# Altium schematic sheet Integrator.SchDoc
size 594 x 420 mm; Address1: Address1; Address2: Address2; Address3: Address3; Address4: Address4; SheetNumber: 1; Scale: 1:1; Разраб.: Иванов; Обозначение документа: АБВГ.123456.001 Э3; Пров.: Петров; Утв.: Сидоров; Наименование организации: ОАО "Концерн "МПО-Гидроприбор"; Перв. применение: АБВГ.123456.000; Наименование изделия 1: Плата; Наименование изделия 2: Схема электрическая; Наименование изделия 3: принципиальная; Нач. отд.: Нач. отд.; Фамилия нач. отд.: Сидоров
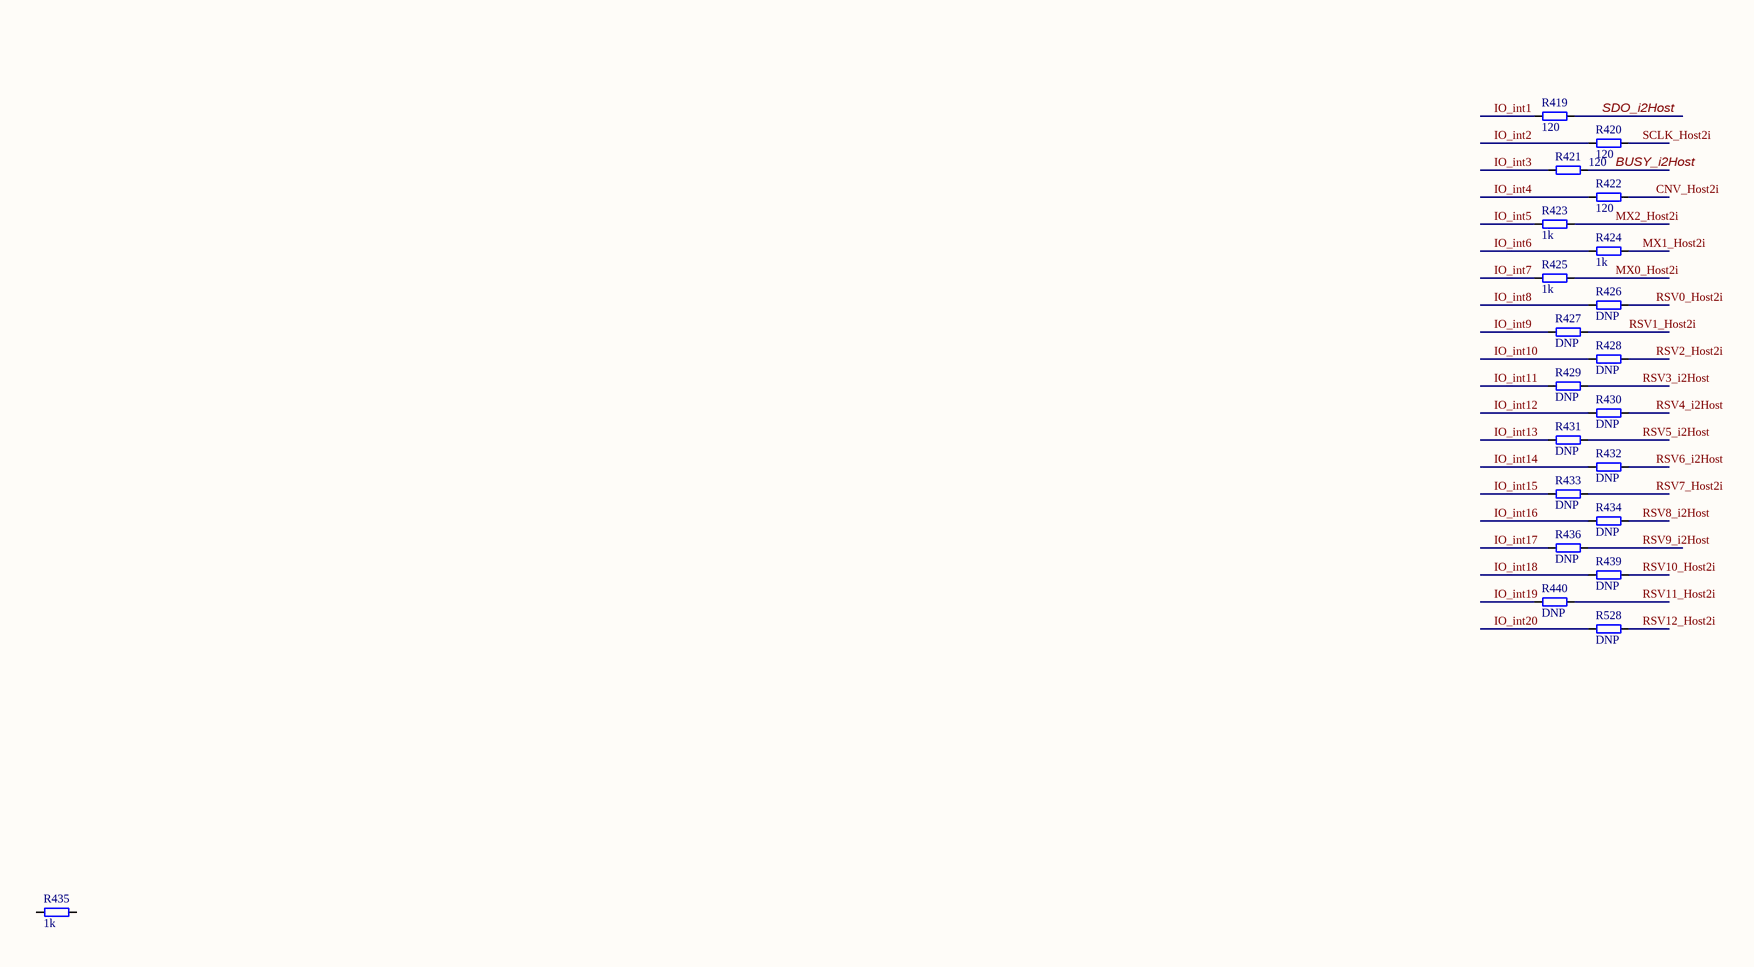
[diagram p0: Integrator.SchDoc, left]
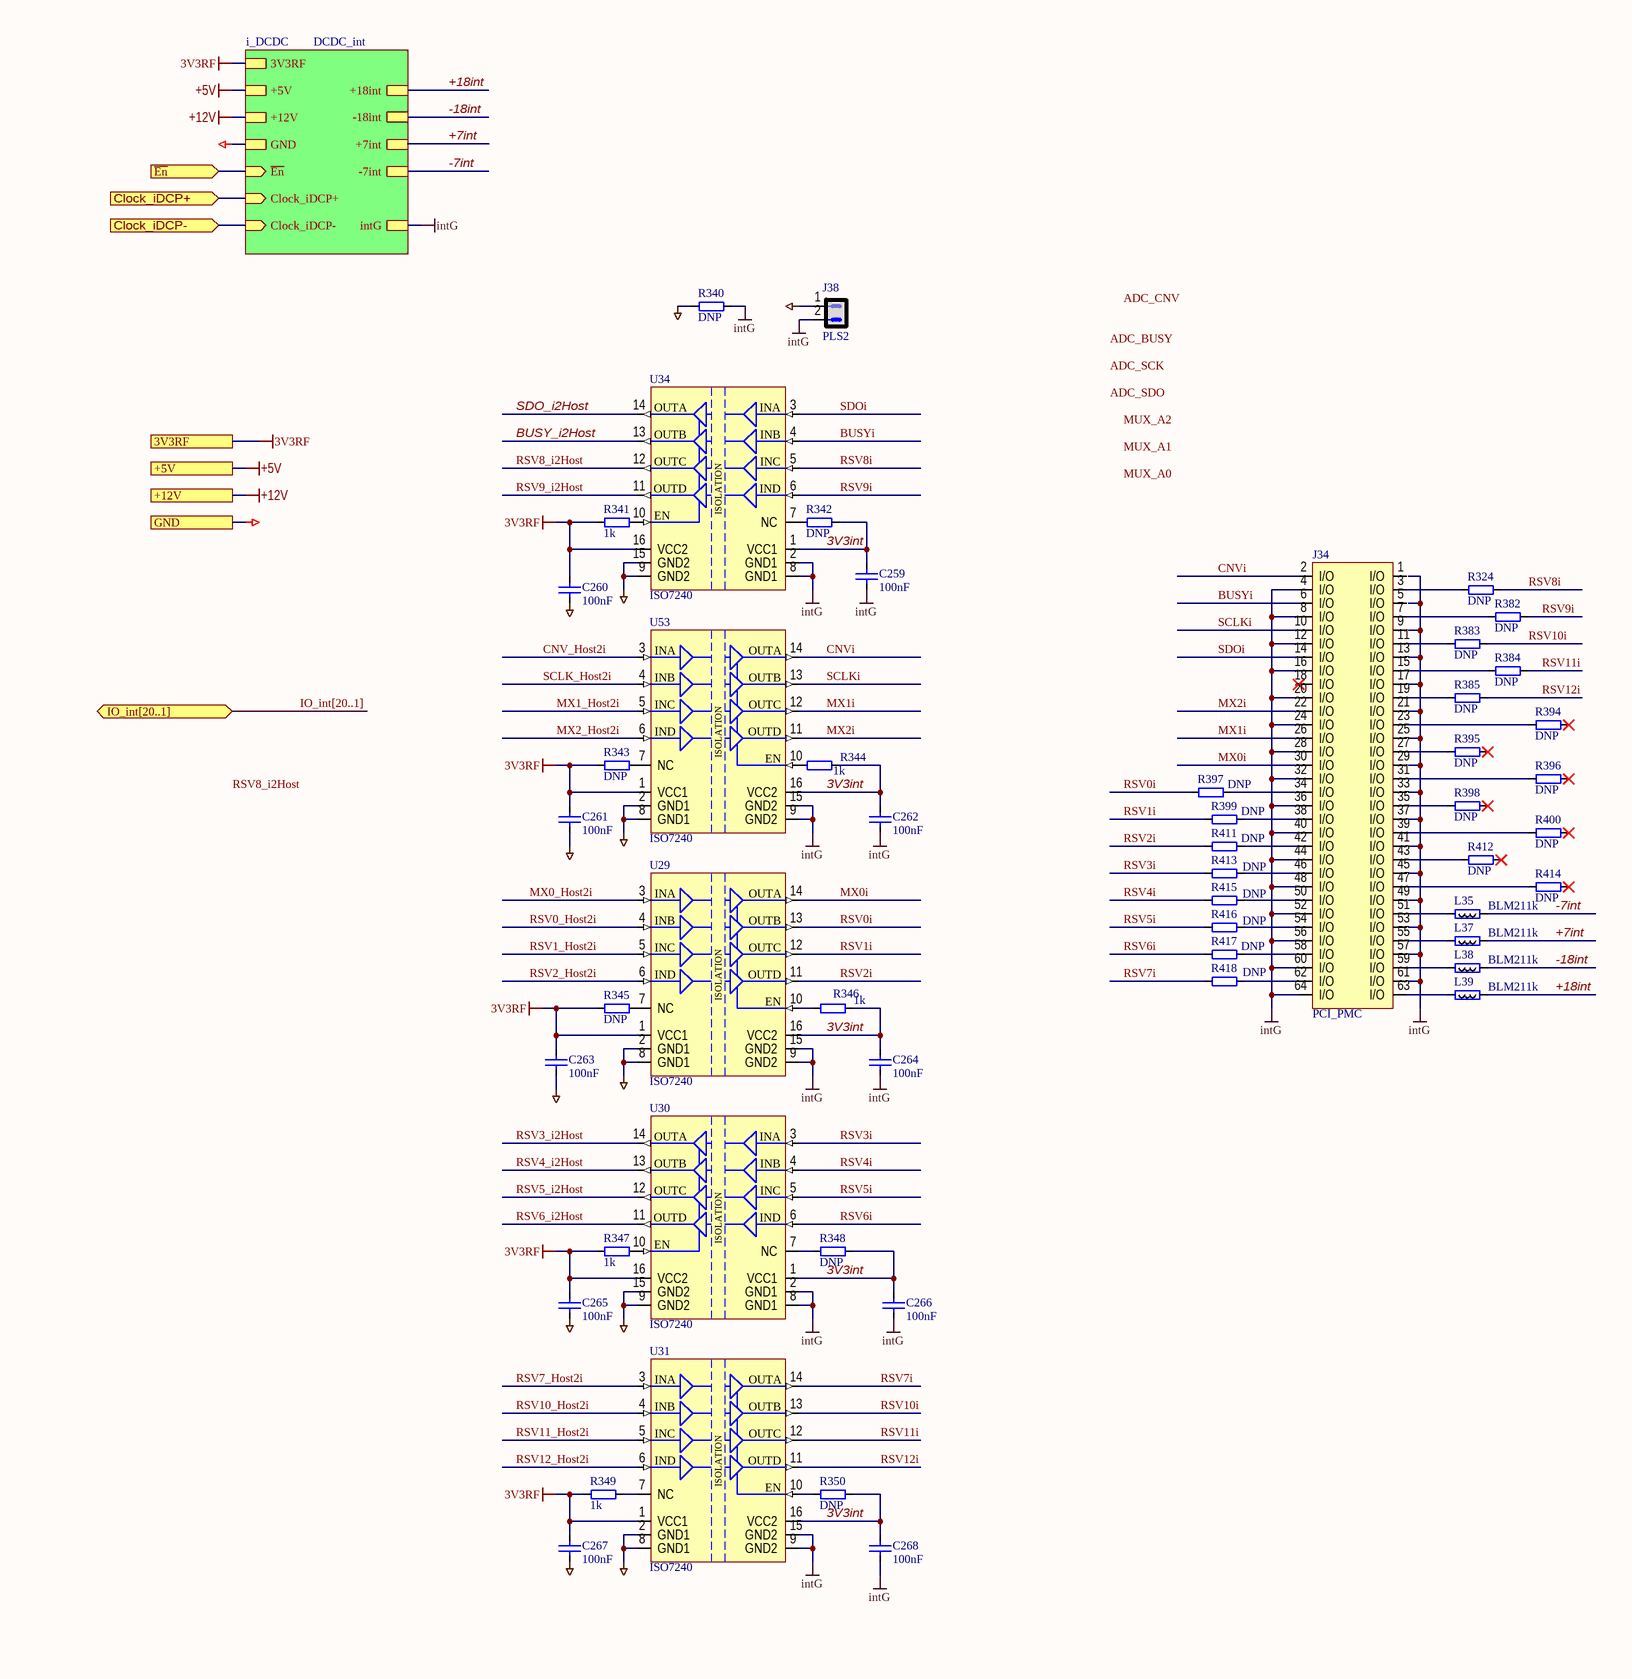
[diagram p1: Integrator.SchDoc, right]

## Parts
C259  100nF  [SMD0805CAP]
C260  100nF  [SMD0805CAP]
C261  100nF  [SMD0805CAP]
C262  100nF  [SMD0805CAP]
C263  100nF  [SMD0805CAP]
C264  100nF  [SMD0805CAP]
C265  100nF  [SMD0805CAP]
C266  100nF  [SMD0805CAP]
C267  100nF  [SMD0805CAP]
C268  100nF  [SMD0805CAP]
J34  PCI_PMC  [TYCO_120521-1]
J38  PLS2  [PLS2]
L35  BLM211k  [RESC2012X50N]
L37  BLM211k  [RESC2012X50N]
L38  BLM211k  [RESC2012X50N]
L39  BLM211k  [RESC2012X50N]
R324  DNP  [SMD0805RES]
R340  DNP  [SMD0805RES]
R341  1k  [SMD0805RES]
R342  DNP  [SMD0805RES]
R343  DNP  [SMD0805RES]
R344  1k  [SMD0805RES]
R345  DNP  [SMD0805RES]
R346  1k  [SMD0805RES]
R347  1k  [SMD0805RES]
R348  DNP  [SMD0805RES]
R349  1k  [SMD0805RES]
R350  DNP  [SMD0805RES]
R382  DNP  [SMD0805RES]
R383  DNP  [SMD0805RES]
R384  DNP  [SMD0805RES]
R385  DNP  [SMD0805RES]
R394  DNP  [SMD0805RES]
R395  DNP  [SMD0805RES]
R396  DNP  [SMD0805RES]
R397  DNP  [SMD0805RES]
R398  DNP  [SMD0805RES]
R399  DNP  [SMD0805RES]
R400  DNP  [SMD0805RES]
R411  DNP  [SMD0805RES]
R412  DNP  [SMD0805RES]
R413  DNP  [SMD0805RES]
R414  DNP  [SMD0805RES]
R415  DNP  [SMD0805RES]
R416  DNP  [SMD0805RES]
R417  DNP  [SMD0805RES]
R418  DNP  [SMD0805RES]
R419  120  [SMD0805RES]
R420  120  [SMD0805RES]
R421  120  [SMD0805RES]
R422  120  [SMD0805RES]
R423  1k  [SMD0805RES]
R424  1k  [SMD0805RES]
R425  1k  [SMD0805RES]
R426  DNP  [SMD0805RES]
R427  DNP  [SMD0805RES]
R428  DNP  [SMD0805RES]
R429  DNP  [SMD0805RES]
R430  DNP  [SMD0805RES]
R431  DNP  [SMD0805RES]
R432  DNP  [SMD0805RES]
R433  DNP  [SMD0805RES]
R434  DNP  [SMD0805RES]
R435  1k  [SMD0805RES]
R436  DNP  [SMD0805RES]
R439  DNP  [SMD0805RES]
R440  DNP  [SMD0805RES]
R528  DNP  [SMD0805RES]
U29  ISO7240  [SOIC127P1030X265-16N]
U30  ISO7240  [SOIC127P1030X265-16N]
U31  ISO7240  [SOIC127P1030X265-16N]
U34  ISO7240  [SOIC127P1030X265-16N]
U53  ISO7240  [SOIC127P1030X265-16N]

## Sub-sheets
i_DCDC = DCDC_int: +18int, -18int, -7int, +7int, ~{En} (in), Clock_iDCP- (in), Clock_iDCP+ (in), +5V, +12V, GND, 3V3RF, intG

## Ports
3V3RF, +5V, +12V, Clock_iDCP+ (in), Clock_iDCP- (in), GND, IO_int[20..1] (bidir), ~{En} (in)

## Nets
3V3RF: C260.2 C261.2 C263.2 C265.2 C267.2 R341.1 R343.1 R345.1 R347.1 R349.1 U29.1(VCC1) U30.16(VCC2) U31.1(VCC1) U34.16(VCC2) U53.1(VCC1) ; port 3V3RF, sheet i_DCDC/3V3RF
+5V: port +5V, sheet i_DCDC/+5V
+12V: port +12V, sheet i_DCDC/+12V
GND: C260.1 C261.1 C263.1 C265.1 C267.1 J38.1 R340.1 U29.2(GND1) U29.8(GND1) U30.9(GND2) U30.15(GND2) U31.2(GND1) U31.8(GND1) U34.9(GND2) U34.15(GND2) U53.2(GND1) U53.8(GND1) ; port GND, sheet i_DCDC/GND
intG: C259.1 C262.1 C264.1 C266.1 C268.1 J34.4(I/O) J34.8(I/O) J34.12(I/O) J34.16(I/O) J34.20(I/O) J34.24(I/O) J34.28(I/O) J34.32(I/O) J34.36(I/O) J34.40(I/O) J34.44(I/O) J34.48(I/O) J34.52(I/O) J34.56(I/O) J34.60(I/O) J34.64(I/O) J38.2 R340.2 U29.9(GND2) U29.15(GND2) U30.2(GND1) U30.8(GND1) U31.9(GND2) U31.15(GND2) U34.2(GND1) U34.8(GND1) U53.9(GND2) U53.15(GND2) ; sheet i_DCDC/intG
3V3int: C259.2 C262.2 C264.2 C266.2 C268.2 R342.2 R344.2 R346.2 R348.2 R350.2 U29.16(VCC2) U30.1(VCC1) U31.16(VCC2) U34.1(VCC1) U53.16(VCC2)
+7int: L37.2 ; sheet i_DCDC/+7int
+18int: L39.2 ; sheet i_DCDC/+18int
-7int: L35.2 ; sheet i_DCDC/-7int
-18int: L38.2 ; sheet i_DCDC/-18int
~{En}: port ~{En}, sheet i_DCDC/~{En}
BUSY_i2Host: R421.2 U34.13(OUTB)
BUSYi: J34.6(I/O) U34.4(INB)
Clock_iDCP+: port Clock_iDCP+, sheet i_DCDC/Clock_iDCP+
Clock_iDCP-: port Clock_iDCP-, sheet i_DCDC/Clock_iDCP-
CNV_Host2i: R422.2 U53.3(INA)
CNVi: J34.2(I/O) U53.14(OUTA)
IO_int1: R419.1
IO_int2: R420.1
IO_int3: R421.1
IO_int4: R422.1
IO_int5: R423.1
IO_int6: R424.1
IO_int7: R425.1
IO_int8: R426.1
IO_int9: R427.1
IO_int10: R428.1
IO_int11: R429.1
IO_int12: R430.1
IO_int13: R431.1
IO_int14: R432.1
IO_int15: R433.1
IO_int16: R434.1
IO_int17: R436.1
IO_int18: R439.1
IO_int19: R440.1
IO_int20: R528.1
MX0_Host2i: R425.2 U29.3(INA)
MX0i: J34.30(I/O) U29.14(OUTA)
MX1_Host2i: R424.2 U53.5(INC)
MX1i: J34.26(I/O) U53.12(OUTC)
MX2_Host2i: R423.2 U53.6(IND)
MX2i: J34.22(I/O) U53.11(OUTD)
RSV0_Host2i: R426.2 U29.4(INB)
RSV0i: R397.1 U29.13(OUTB)
RSV1_Host2i: R427.2 U29.5(INC)
RSV1i: R399.1 U29.12(OUTC)
RSV2_Host2i: R428.2 U29.6(IND)
RSV2i: R411.1 U29.11(OUTD)
RSV3_i2Host: R429.2 U30.14(OUTA)
RSV3i: R413.1 U30.3(INA)
RSV4_i2Host: R430.2 U30.13(OUTB)
RSV4i: R415.1 U30.4(INB)
RSV5_i2Host: R431.2 U30.12(OUTC)
RSV5i: R416.1 U30.5(INC)
RSV6_i2Host: R432.2 U30.11(OUTD)
RSV6i: R417.1 U30.6(IND)
RSV7_Host2i: R433.2 U31.3(INA)
RSV7i: R418.1 U31.14(OUTA)
RSV8_i2Host: R434.2 U34.12(OUTC)
RSV8i: R324.2 U34.5(INC)
RSV9_i2Host: R436.2 U34.11(OUTD)
RSV9i: R382.2 U34.6(IND)
RSV10_Host2i: R439.2 U31.4(INB)
RSV10i: R383.2 U31.13(OUTB)
RSV11_Host2i: R440.2 U31.5(INC)
RSV11i: R384.2 U31.12(OUTC)
RSV12_Host2i: R528.2 U31.6(IND)
RSV12i: R385.2 U31.11(OUTD)
SCLK_Host2i: R420.2 U53.4(INB)
SCLKi: J34.10(I/O) U53.13(OUTB)
SDO_i2Host: R419.2 U34.14(OUTA)
SDOi: J34.14(I/O) U34.3(INA)
NetJ34_3: J34.3(I/O) R324.1
NetJ34_7: J34.7(I/O) R382.1
NetJ34_11: J34.11(I/O) R383.1
NetJ34_15: J34.15(I/O) R384.1
NetJ34_19: J34.19(I/O) R385.1
NetJ34_23: J34.23(I/O) R394.1
NetJ34_27: J34.27(I/O) R395.1
NetJ34_31: J34.31(I/O) R396.1
NetJ34_34: J34.34(I/O) R397.2
NetJ34_35: J34.35(I/O) R398.1
NetJ34_38: J34.38(I/O) R399.2
NetJ34_39: J34.39(I/O) R400.1
NetJ34_42: J34.42(I/O) R411.2
NetJ34_43: J34.43(I/O) R412.1
NetJ34_46: J34.46(I/O) R413.2
NetJ34_47: J34.47(I/O) R414.1
NetJ34_50: J34.50(I/O) R415.2
NetJ34_51: J34.51(I/O) L35.1
NetJ34_54: J34.54(I/O) R416.2
NetJ34_55: J34.55(I/O) L37.1
NetJ34_58: J34.58(I/O) R417.2
NetJ34_59: J34.59(I/O) L38.1
NetJ34_62: J34.62(I/O) R418.2
NetJ34_63: J34.63(I/O) L39.1
NetR341_2: R341.2 U34.10(EN)
NetR342_1: R342.1 U34.7(NC)
NetR343_2: R343.2 U53.7(NC)
NetR344_1: R344.1 U53.10(EN)
NetR345_2: R345.2 U29.7(NC)
NetR346_1: R346.1 U29.10(EN)
NetR347_2: R347.2 U30.10(EN)
NetR348_1: R348.1 U30.7(NC)
NetR349_2: R349.2 U31.7(NC)
NetR350_1: R350.1 U31.10(EN)

Not connected (* = marked no-connect by the designer): J34 1(I/O) 5(I/O) 9(I/O) 13(I/O) 17(I/O) 18(I/O)* 21(I/O) 25(I/O) 29(I/O) 33(I/O) 37(I/O) 41(I/O) 45(I/O) 49(I/O) 53(I/O) 57(I/O) 61(I/O); R394 2*; R395 2*; R396 2*; R398 2*; R400 2*; R412 2*; R414 2*; R435 1 2

## Buses and harness runs
bus IO_int[20..1] = port IO_int[20..1]

## Notes on the sheet
- Labels drawn without touching a wire or pin: ADC_BUSY, ADC_CNV, ADC_SCK, ADC_SDO, MUX_A0, MUX_A1, MUX_A2, RSV8_i2Host
- Подп. и дата
- Инв. № дубл.
- Взам. инв. №
- Инв. № подл.
- Изм.
- Лист
- № докум.
- Подп.
- Дата
- Копировал
- Формат А2
- (in symbol ISO7240M) ISOLATION

## Library data of the parts
C259-C268 = C0805: Чип конденсатор 0805; Voltage: 25V; Vendor: Vishay; DielectricType: X5R; SMD Solders: 2; Solder Option: RM; Tolerance: 20%; Pkg: SMD0805; Device: Cap0805; Value: 100nF; Price: 2
J34 = PCI_PMC_M: PCI Mezzanine Connector; IEEE 1386 MainBoard; Manufactuer: TE Connectivity; PartField: 120527-1; SolderOption: 2; Pkg: PMC Male (IEEE 1386); Value: PCI_PMC; Vendor: TE Connectivity
J38 = PLS2: Vendor: Confly; SMD Solders: 0; Solder Option: RM; THD Solders: 2; Price: 1; Device: PLS2
L35 L37-L39 = BLM21: SMD Ferrite bead 0805; Vendor: Vishay; Value: 1k; Pkg: SMD0805; SMD Solders: 2; Solder Option: RM; Price: 10; Device: BLM21
R324 R341 R344 R346 R347 R349 R382-R385 R394-R400 R411-R436 R439 R440 R528 = R0805: Чип резистор 0805; Vendor: Vishay; SMD Solders: 2; Solder Option: RM; TC: 100ppm/C; Tolerance: 1%; Pkg: SMD0805; Pwr: 125mW; Device: Res0805; Price: 2
  R324 R382-R385 R394-R400 R411-R418 R426-R434 R436 R439 R440 R528: Value: DNP
  R341 R344 R346 R347 R349 R423-R425 R435: Value: 1k
  R419-R422: Value: 120
R340 R342 R343 R345 R348 R350 = R0805: Чип резистор 0805; Vendor: Vishay; SMD Solders: 2; Solder Option: i; TC: 100ppm/C; Tolerance: 1%; Pkg: SMD0805; Pwr: 125mW; Device: Res0805; Price: 2; Value: DNP
U29-U31 U34 U53 = ISO7240M: Двунаправленный буфер; Pkg: SOIC16DW; SMD Solders: 16; Solder Option: RM; THD Solders: 0; Vendor: Texas Instruments; Voltage: 3V3 or 5V; Name to order: ISO7240MDWR; Current: 30; Device: ISO7240; Price: 3500